# Altium schematic sheet S0_COVER_PAGE.SchDoc
size Letter; DocumentNumber: 1; Revision: 1-0; SheetNumber: 0; SheetTotal: 6
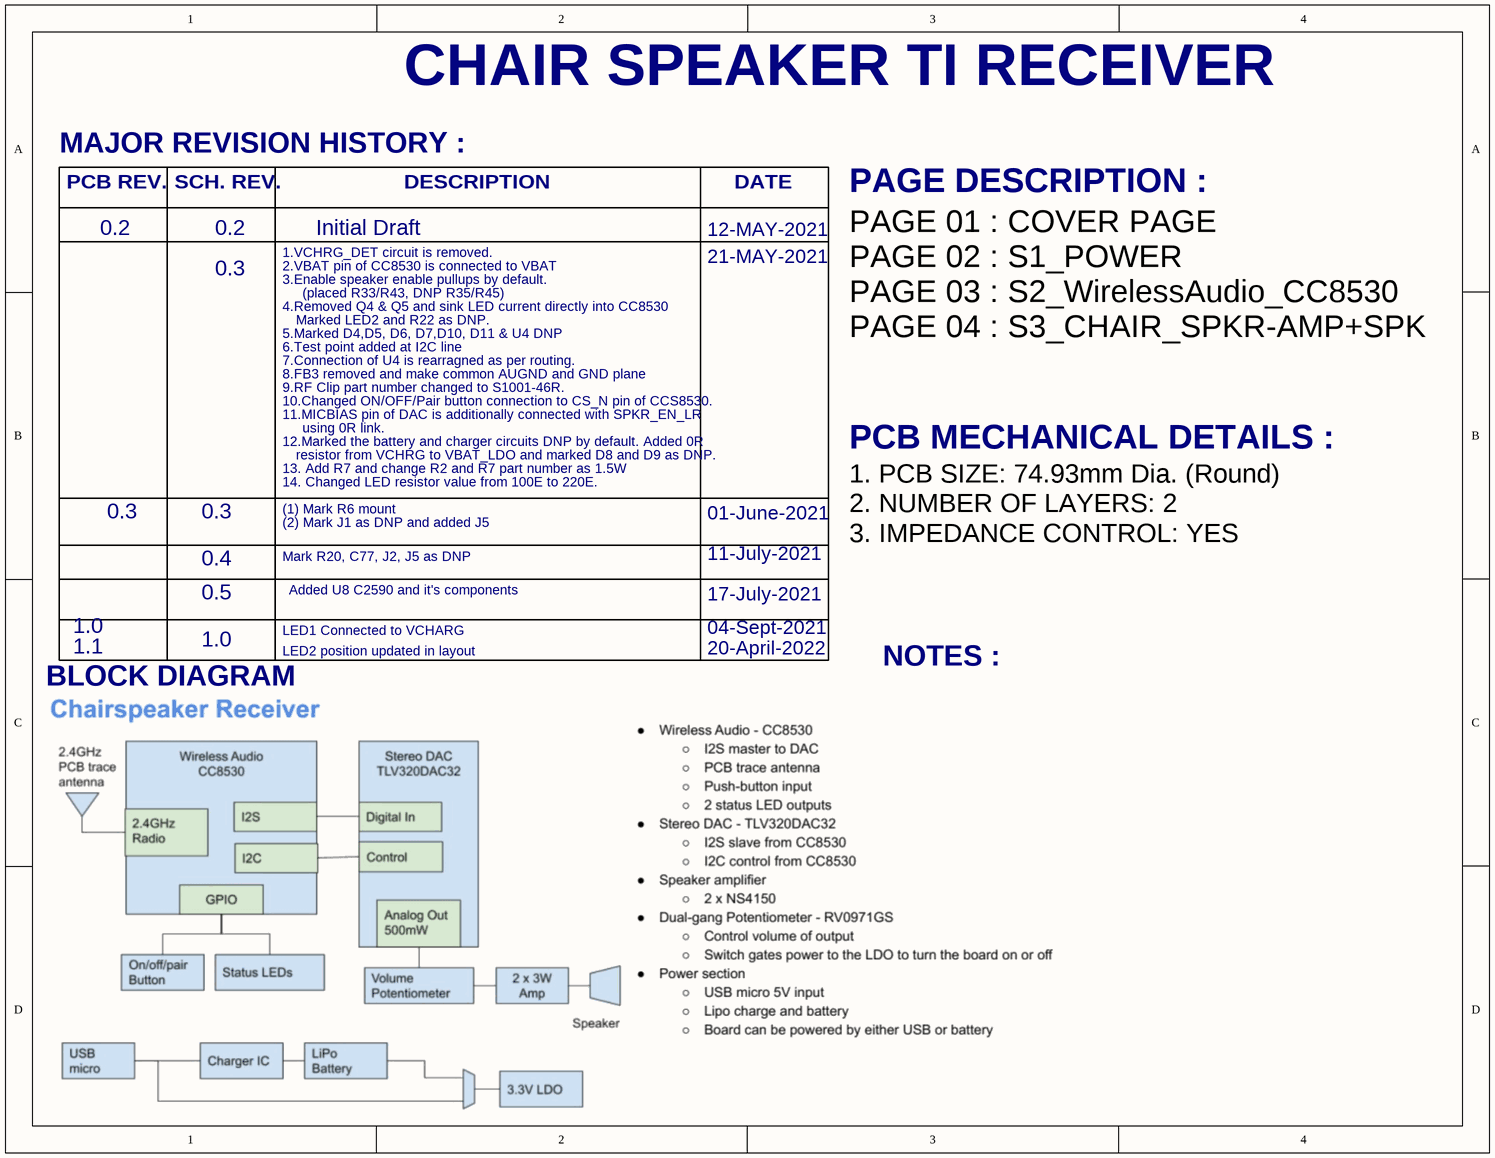
[diagram p0: S0_COVER_PAGE.SchDoc]

## Notes on the sheet
- CHAIR SPEAKER TI RECEIVER
- MAJOR REVISION HISTORY :
- PCB REV.
- 0.2
- SCH. REV.
- Initial Draft
- DESCRIPTION
- 12-MAY-2021
- DATE
- PAGE DESCRIPTION :
- 0.3
- 1.VCHRG_DET circuit is removed.
- 2.VBAT pin of CC8530 is connected to VBAT
- 3.Enable speaker enable pullups by default.
- (placed R33/R43, DNP R35/R45)
- 21-MAY-2021
- 4.Removed Q4 & Q5 and sink LED current directly into CC8530
- 5.Marked D4,D5, D6, D7,D10, D11 & U4 DNP
- 6.Test point added at I2C line
- 7.Connection of U4 is rearragned as per routing.
- Marked LED2 and R22 as DNP.
- PAGE 01 : COVER PAGE
  PAGE 02 : S1_POWER
  PAGE 03 : S2_WirelessAudio_CC8530
  PAGE 04 : S3_CHAIR_SPKR-AMP+SPK
- 8.FB3 removed and make common AUGND and GND plane
- 9.RF Clip part number changed to S1001-46R.
- 10.Changed ON/OFF/Pair button connection to CS_N pin of CCS8530.
- 11.MICBIAS pin of DAC is additionally connected with SPKR_EN_LR
- using 0R link.
- 12.Marked the battery and charger circuits DNP by default. Added 0R
- 13. Add R7 and change R2 and R7 part number as 1.5W
- 14. Changed LED resistor value from 100E to 220E.
- resistor from VCHRG to VBAT_LDO and marked D8 and D9 as DNP.
- PCB MECHANICAL DETAILS :
- 0.4
- (1) Mark R6 mount
- (2) Mark J1 as DNP and added J5
- Mark R20, C77, J2, J5 as DNP
- 01-June-2021
- 11-July-2021
- 1. PCB SIZE: 74.93mm Dia. (Round)
  2. NUMBER OF LAYERS: 2
  3. IMPEDANCE CONTROL: YES
- 1.0
- 0.5
- LED1 Connected to VCHARG
- Added U8 C2590 and it's components
- 17-July-2021
- 04-Sept-2021
- BLOCK DIAGRAM
- 1.1
- LED2 position updated in layout
- 20-April-2022
- NOTES :
- Title
- Size:
- Date:
- B
- Number:
- Time:
- Revision:
- Sheet
- of
- File: